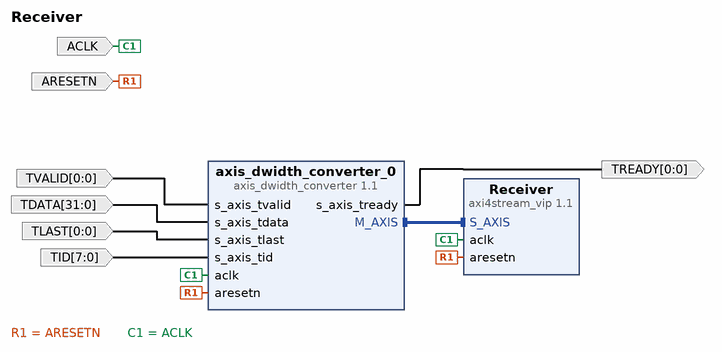
[diagram p0: block diagram of the top level]
# Vivado block design Receiver, xc7z010clg400-1, Vivado 2018.3
create_bd_design Receiver

create_bd_port -dir I -from 0 -to 0 TLAST
create_bd_port -dir O -from 0 -to 0 TREADY
create_bd_port -dir I -type rst ARESETN
create_bd_port -dir I -from 0 -to 0 TVALID
create_bd_port -dir I -type clk ACLK
set_property -dict {CONFIG.FREQ_HZ 125000000} [get_bd_ports ACLK]
create_bd_port -dir I -from 31 -to 0 TDATA
create_bd_port -dir I -from 7 -to 0 TID

create_bd_cell -type ip -vlnv xilinx.com:ip:axi4stream_vip:1.1 Receiver
set_property -dict {CONFIG.INTERFACE_MODE SLAVE} [get_bd_cells Receiver]
create_bd_cell -type ip -vlnv xilinx.com:ip:axis_dwidth_converter:1.1 axis_dwidth_converter_0
set_property -dict [list \
  CONFIG.HAS_MI_TKEEP 1 \
  CONFIG.HAS_TLAST 1 \
  CONFIG.M_TDATA_NUM_BYTES 8 \
  CONFIG.S_TDATA_NUM_BYTES 4 \
  CONFIG.TID_WIDTH 8 \
] [get_bd_cells axis_dwidth_converter_0]

# ---- connections ----

connect_bd_intf_net [get_bd_intf_pins axis_dwidth_converter_0/M_AXIS] [get_bd_intf_pins Receiver/S_AXIS]
connect_bd_net [get_bd_ports ARESETN] [get_bd_pins Receiver/aresetn] [get_bd_pins axis_dwidth_converter_0/aresetn]
connect_bd_net [get_bd_ports ACLK] [get_bd_pins Receiver/aclk] [get_bd_pins axis_dwidth_converter_0/aclk]
connect_bd_net [get_bd_ports TVALID] [get_bd_pins axis_dwidth_converter_0/s_axis_tvalid]
connect_bd_net [get_bd_pins axis_dwidth_converter_0/s_axis_tready] [get_bd_ports TREADY]
connect_bd_net [get_bd_ports TDATA] [get_bd_pins axis_dwidth_converter_0/s_axis_tdata]
connect_bd_net [get_bd_ports TLAST] [get_bd_pins axis_dwidth_converter_0/s_axis_tlast]
connect_bd_net [get_bd_ports TID] [get_bd_pins axis_dwidth_converter_0/s_axis_tid]

validate_bd_design
save_bd_design
